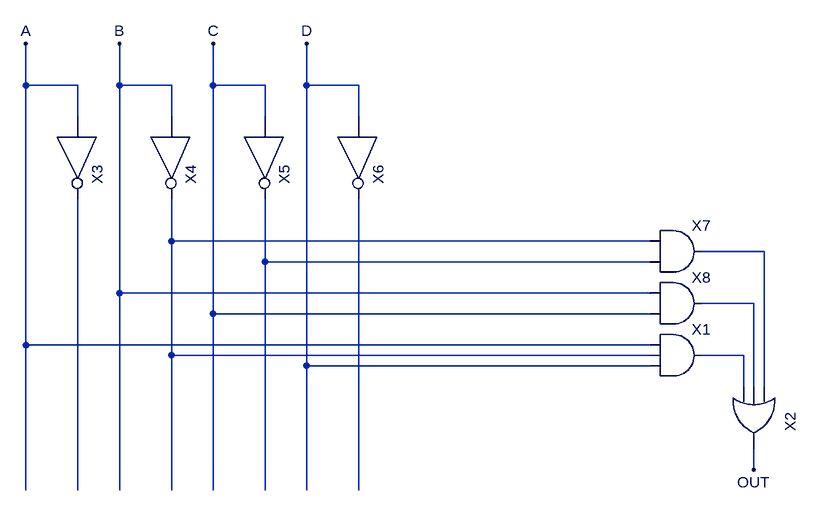
[diagram p0: schematic Fonction.asc]
Fonction.asc, the LTspice schematic file:
Version 4
SHEET 1 884 680
WIRE -368 -80 -368 -144
WIRE -288 -80 -368 -80
WIRE -224 -80 -224 -144
WIRE -144 -80 -224 -80
WIRE -80 -80 -80 -144
WIRE 0 -80 -80 -80
WIRE 64 -80 64 -144
WIRE 144 -80 64 -80
WIRE -288 -32 -288 -80
WIRE -144 -32 -144 -80
WIRE 0 -32 0 -80
WIRE 144 -32 144 -80
WIRE -144 160 -144 96
WIRE 592 160 -144 160
WIRE 768 176 672 176
WIRE 0 192 0 96
WIRE 592 192 0 192
WIRE -224 240 -224 -80
WIRE 592 240 -224 240
WIRE 752 256 672 256
WIRE -80 272 -80 -80
WIRE 592 272 -80 272
WIRE -368 320 -368 -80
WIRE 592 320 -368 320
WIRE -144 336 -144 160
WIRE 592 336 -144 336
WIRE 736 336 672 336
WIRE 64 352 64 -80
WIRE 592 352 64 352
WIRE 736 384 736 336
WIRE 752 384 752 256
WIRE 768 384 768 176
WIRE 752 512 752 480
WIRE -368 544 -368 320
WIRE -288 544 -288 96
WIRE -224 544 -224 240
WIRE -144 544 -144 336
WIRE -80 544 -80 272
WIRE 0 544 0 192
WIRE 64 544 64 352
WIRE 144 544 144 96
FLAG 752 512 OUT
FLAG -368 -144 A
FLAG -224 -144 B
FLAG -80 -144 C
FLAG 64 -144 D
SYMBOL AND3 640 272 R0
SYMATTR InstName X1
SYMBOL OR3 816 432 R90
SYMATTR InstName X2
SYMBOL NOT -256 0 R90
SYMATTR InstName X3
SYMBOL NOT -112 0 R90
SYMATTR InstName X4
SYMBOL NOT 32 0 R90
SYMATTR InstName X5
SYMBOL NOT 176 0 R90
SYMATTR InstName X6
SYMBOL AND2 640 112 R0
SYMATTR InstName X7
SYMBOL AND2 640 192 R0
SYMATTR InstName X8

The netlist it stands for:
* Fonction.asc
XX1 A D N005 N001 AND3  ; pins In1 In3 Out In2
XX2 N002 N004 N005 OUT OR3  ; pins In1 In2 In3 Out
XX3 A N006 NOT  ; pins In Out
XX4 B N001 NOT  ; pins In Out
XX5 C N003 NOT  ; pins In Out
XX6 D N007 NOT  ; pins In Out
XX7 N001 N003 N002 AND2  ; pins In1 In2 Out
XX8 B C N004 AND2  ; pins In1 In2 Out
.backanno
.end